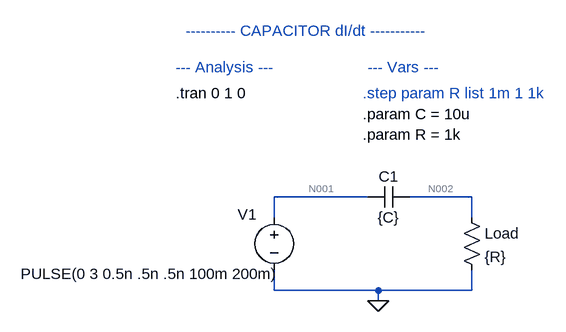
[diagram p0: schematic Capacitor - dI.asc]
Capacitor - dI.asc, the LTspice schematic file:
Version 4.1
SHEET 1 880 680
WIRE 144 128 0 128
WIRE 304 128 208 128
WIRE 0 160 0 128
WIRE 304 160 304 128
WIRE 0 272 0 240
WIRE 160 272 0 272
WIRE 304 272 304 240
WIRE 304 272 160 272
WIRE 160 288 160 272
FLAG 160 288 0
SYMBOL cap 208 112 R90
WINDOW 0 0 32 VBottom 2
WINDOW 3 32 32 VTop 2
SYMATTR InstName C1
SYMATTR Value {C}
SYMBOL res 288 144 R0
SYMATTR InstName Load
SYMATTR Value {R}
SYMBOL voltage 0 144 R0
WINDOW 0 -56 11 Left 2
WINDOW 3 -390 102 Left 2
WINDOW 123 0 0 Left 0
WINDOW 39 0 0 Left 0
SYMATTR InstName V1
SYMATTR Value PULSE(0 3 0.5n .5n .5n 100m 200m)
TEXT -136 -128 Left 2 ;---------- CAPACITOR dI/dt -----------
TEXT 136 -32 Left 2 ;.step param R list 1m 1 1k
TEXT 136 0 Left 2 !.param C = 10u
TEXT -152 -32 Left 2 !.tran 0 1 0
TEXT -152 -72 Left 2 ;--- Analysis ---
TEXT 144 -72 Left 2 ;--- Vars ---
TEXT 136 32 Left 2 !.param R = 1k

The netlist it stands for:
* Capacitor - dI.asc
C1 N002 N001 {C}
R§Load N002 0 {R}
V1 N001 0 PULSE(0 3 0.5n .5n .5n 100m 200m)
* ---------- CAPACITOR dI/dt -----------
* .step param R list 1m 1 1k
.param C = 10u
.tran 0 1 0
* --- Analysis ---
* --- Vars ---
.param R = 1k
.backanno
.end

* Results of the author's LTspice run, read from the files saved beside the schematic
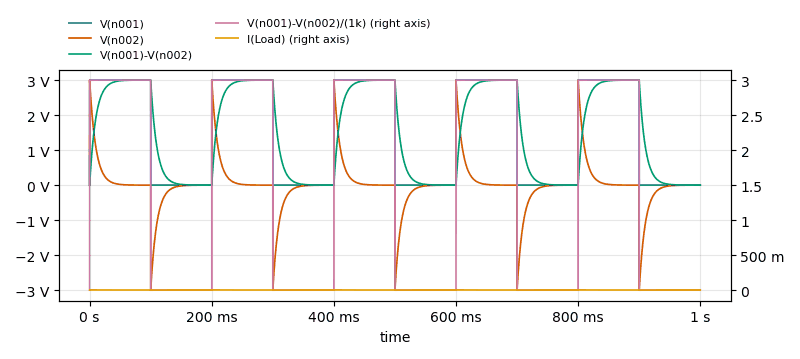
[diagram p1: Transient Analysis of Capacitor - dI.asc, plotted from the saved traces]
* Transient Analysis, 1 run:
*   V(n001): min 0 V, max 3 V, average 1.5 V, rms 2.121 V, last 0 V
*   V(n002): min -3 V, max 3 V, average 1.35 µV, rms 671.5 mV, last -135.1 µV
*   V(n001)-V(n002): min 0 V, max 3 V, average 1.5 V, rms 2.013 V, last 135.1 µV
*   V(n001)-V(n002)/(1k): min 0, max 3 , average 1.5 , rms 2.121 , last 0
*   I(Load): min -3 mA, max 3 mA, average 1.35 nA, rms 671.5 µA, last -135.1 nA